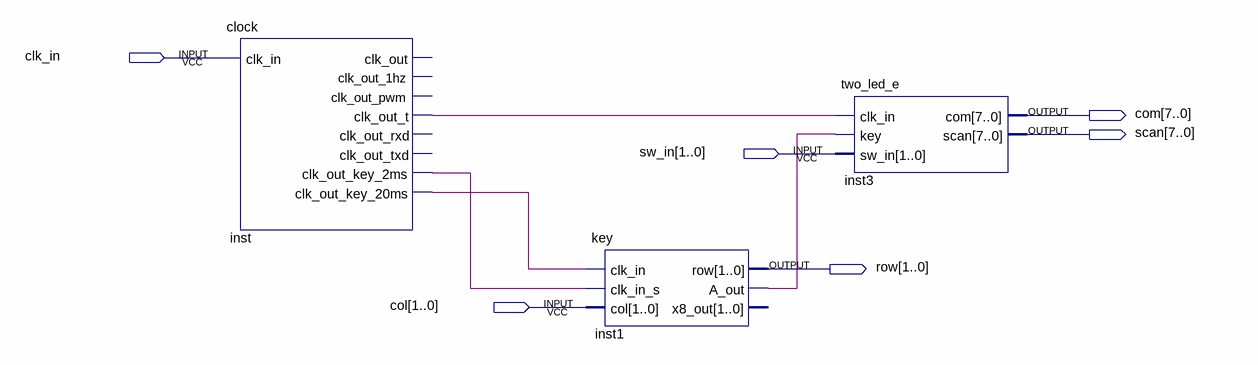
[diagram p0: schematic sheet]
// Quartus schematic two_led_e_bdf.bdf as structural Verilog: 3 symbols, 6 pins
module two_led_e_bdf (
  input  clk_in,
  input  [1:0] sw_in,
  input  [1:0] col,
  output [7:0] com,
  output [7:0] scan,
  output [1:0] row
);

  wire inst1_a_out, inst_clk_out_key_2ms, inst_clk_out_key_20ms, inst_clk_out_t;

  clock inst (
    .clk_in(clk_in), .clk_out_t(inst_clk_out_t), .clk_out_key_2ms(inst_clk_out_key_2ms),
    .clk_out_key_20ms(inst_clk_out_key_20ms));  // open: clk_out, clk_out_1hz, clk_out_pwm, clk_out_rxd, clk_out_txd
  key inst1 (
    .clk_in(inst_clk_out_key_20ms), .clk_in_s(inst_clk_out_key_2ms), .col(col), .row(row), .A_out(inst1_a_out));  // open: x8_out
  two_led_e inst3 (.clk_in(inst_clk_out_t), .key(inst1_a_out), .sw_in(sw_in), .com(com), .scan(scan));
endmodule
